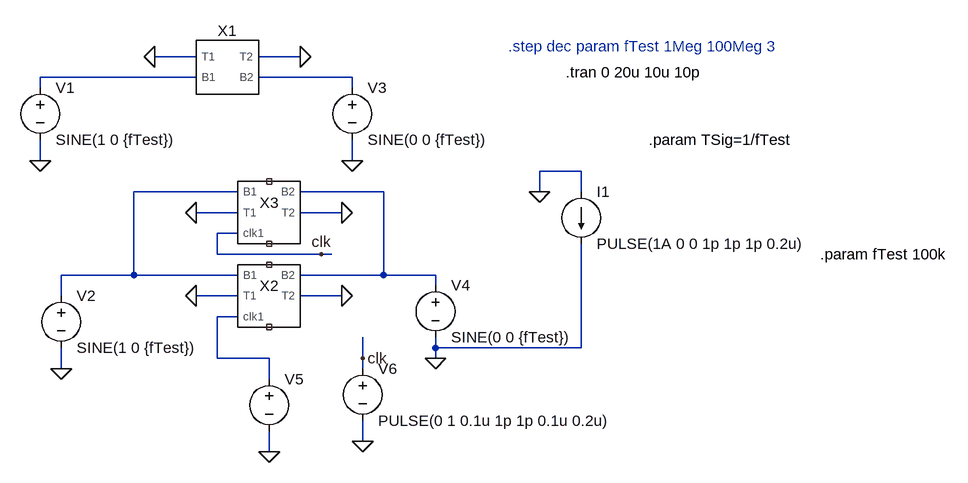
[diagram p0: schematic 4Term_TB.asc]
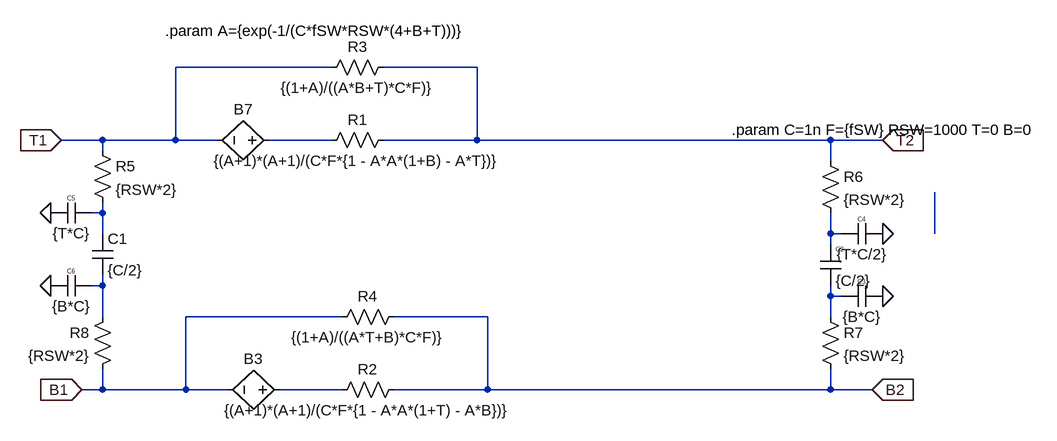
[diagram p1: sub-circuit 4term_model_eq.asc]
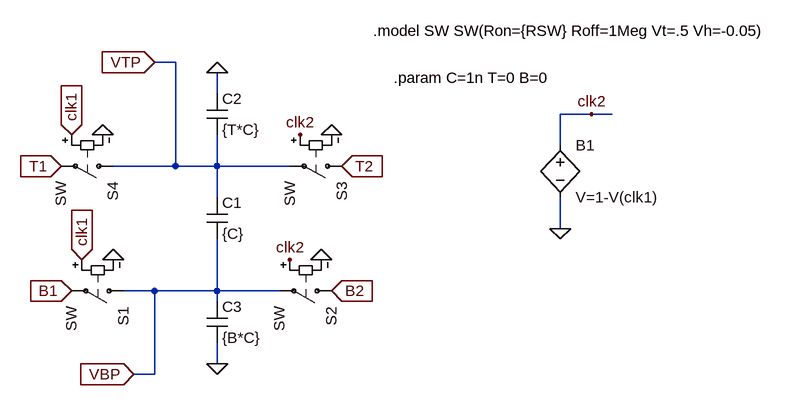
[diagram p2: sub-circuit sccore.asc]
4Term_TB.asc, the LTspice schematic file:
Version 4
SHEET 1 1288 788
WIRE 112 160 48 160
WIRE 272 160 208 160
WIRE 112 192 -128 192
WIRE 352 192 208 192
WIRE -128 208 -128 192
WIRE 352 208 352 192
WIRE -128 320 -128 288
WIRE 352 320 352 288
WIRE 704 336 640 336
WIRE 176 368 16 368
WIRE 400 368 272 368
WIRE 640 368 640 336
WIRE 704 368 704 336
WIRE 176 400 112 400
WIRE 336 400 272 400
WIRE 176 432 144 432
WIRE 144 464 144 432
WIRE 304 464 144 464
WIRE 320 464 304 464
WIRE 16 496 16 368
WIRE 16 496 -96 496
WIRE 176 496 16 496
WIRE 400 496 400 368
WIRE 400 496 272 496
WIRE 480 496 400 496
WIRE 480 512 480 496
WIRE -96 528 -96 496
WIRE 176 528 112 528
WIRE 336 528 272 528
WIRE 176 560 144 560
WIRE 480 608 480 592
WIRE 704 608 704 448
WIRE 704 608 480 608
WIRE 144 624 144 560
WIRE 224 624 144 624
WIRE 368 624 368 592
WIRE 480 624 480 608
WIRE -96 640 -96 608
WIRE 368 640 368 624
WIRE 224 656 224 624
WIRE 368 752 368 720
WIRE 224 768 224 736
FLAG -128 320 0
FLAG 352 320 0
FLAG 480 624 0
FLAG 272 160 0
FLAG 48 160 0
FLAG -96 640 0
FLAG 336 528 0
FLAG 112 528 0
FLAG 224 768 0
FLAG 336 400 0
FLAG 112 400 0
FLAG 368 752 0
FLAG 368 624 clk
FLAG 304 464 clk
FLAG 640 368 0
SYMBOL 4term_model_EQ 144 208 R0
SYMATTR InstName X1
SYMATTR SpiceLine C = 2n, RSW=1, B = 0.02, T = 0.02, fSW=5Meg
SYMBOL SCcore 224 528 R0
SYMATTR InstName X2
SYMATTR SpiceLine C = 1n, RSW=0.5, B = 0.02, T = 0.02
SYMBOL voltage -128 192 R0
WINDOW 123 0 0 Left 0
WINDOW 39 0 0 Left 0
SYMATTR InstName V1
SYMATTR Value SINE(1 0 {fTest})
SYMBOL voltage 352 192 R0
WINDOW 123 0 0 Left 0
WINDOW 39 0 0 Left 0
SYMATTR InstName V3
SYMATTR Value SINE(0 0 {fTest})
SYMBOL voltage 480 496 R0
WINDOW 123 0 0 Left 0
WINDOW 39 0 0 Left 0
SYMATTR InstName V4
SYMATTR Value SINE(0 0 {fTest})
SYMBOL voltage -96 512 R0
WINDOW 123 0 0 Left 0
WINDOW 39 0 0 Left 0
SYMATTR InstName V2
SYMATTR Value SINE(1 0 {fTest})
SYMBOL voltage 224 640 R0
WINDOW 3 24 96 Invisible 2
WINDOW 123 0 0 Left 0
WINDOW 39 0 0 Left 0
SYMATTR Value PULSE(0 1 0 1p 1p 0.1u 0.2u)
SYMATTR InstName V5
SYMBOL SCcore 224 400 R0
SYMATTR InstName X3
SYMATTR SpiceLine C = 1n, RSW=0.5, B = 0.02, T = 0.02
SYMBOL voltage 368 624 R0
WINDOW 123 0 0 Left 0
WINDOW 39 0 0 Left 0
SYMATTR InstName V6
SYMATTR Value PULSE(0 1 0.1u 1p 1p 0.1u 0.2u)
SYMBOL current 704 368 R0
WINDOW 123 0 0 Left 0
WINDOW 39 0 0 Left 0
SYMATTR InstName I1
SYMATTR Value PULSE(1A 0 0 1p 1p 1p 0.2u)
TEXT 592 144 Left 2 ;.step dec param fTest 1Meg 100Meg 3
TEXT 680 184 Left 2 !.tran 0 20u 10u 10p
TEXT 808 288 Left 2 !.param TSig=1/fTest
TEXT 1072 464 Left 2 !.param fTest 100k

4term_model_eq.asc, the sub-circuit schematic file:
Version 4
SHEET 1 2172 680
WIRE 912 -416 672 -416
WIRE 1136 -416 992 -416
WIRE 560 -304 496 -304
WIRE 672 -304 672 -416
WIRE 672 -304 560 -304
WIRE 736 -304 672 -304
WIRE 912 -304 816 -304
WIRE 1136 -304 1136 -416
WIRE 1136 -304 992 -304
WIRE 1680 -304 1136 -304
WIRE 1760 -304 1680 -304
WIRE 560 -288 560 -304
WIRE 1680 -272 1680 -304
WIRE 560 -192 560 -208
WIRE 560 -192 544 -192
WIRE 560 -160 560 -192
WIRE 1680 -160 1680 -192
WIRE 1696 -160 1680 -160
WIRE 1840 -160 1840 -224
WIRE 1680 -144 1680 -160
WIRE 560 -80 560 -96
WIRE 560 -80 544 -80
WIRE 1680 -64 1680 -80
WIRE 1696 -64 1680 -64
WIRE 560 -32 560 -80
WIRE 928 -32 688 -32
WIRE 1152 -32 1008 -32
WIRE 1680 -32 1680 -64
WIRE 560 80 560 48
WIRE 560 80 528 80
WIRE 688 80 688 -32
WIRE 688 80 560 80
WIRE 752 80 688 80
WIRE 928 80 832 80
WIRE 1152 80 1152 -32
WIRE 1152 80 1008 80
WIRE 1680 80 1680 48
WIRE 1680 80 1152 80
WIRE 1744 80 1680 80
FLAG 528 80 B1
IOPIN 528 80 In
FLAG 1744 80 B2
IOPIN 1744 80 In
FLAG 496 -304 T1
IOPIN 496 -304 In
FLAG 1760 -304 T2
IOPIN 1760 -304 In
FLAG 1760 -160 0
FLAG 1760 -64 0
FLAG 480 -192 0
FLAG 480 -80 0
SYMBOL bv 848 80 R90
WINDOW 0 -32 56 VBottom 2
WINDOW 3 32 56 Invisible 2
SYMATTR InstName B3
SYMATTR Value V=(V(T2) - V(T1))
SYMBOL res 1008 -320 R90
WINDOW 0 0 56 VBottom 2
WINDOW 3 32 56 VTop 2
SYMATTR InstName R1
SYMATTR Value {(A+1)*(A+1)/(C*F*{1 - A*A*(1+B) - A*T})}
SYMBOL bv 832 -304 R90
WINDOW 0 -32 56 VBottom 2
WINDOW 3 32 56 Invisible 2
SYMATTR InstName B7
SYMATTR Value V=(V(B2) - V(B1))
SYMBOL res 1008 -432 R90
WINDOW 0 0 56 VBottom 2
WINDOW 3 32 56 VTop 2
SYMATTR InstName R3
SYMATTR Value {(1+A)/((A*B+T)*C*F)}
SYMBOL res 1024 -48 R90
WINDOW 0 0 56 VBottom 2
WINDOW 3 32 56 VTop 2
SYMATTR InstName R4
SYMATTR Value {(1+A)/((A*T+B)*C*F)}
SYMBOL res 1024 64 R90
WINDOW 0 0 56 VBottom 2
WINDOW 3 32 56 VTop 2
SYMATTR InstName R2
SYMATTR Value {(A+1)*(A+1)/(C*F*{1 - A*A*(1+T) - A*B})}
SYMBOL res 1664 -288 R0
SYMATTR InstName R6
SYMATTR Value {RSW*2}
SYMBOL cap 544 -160 R0
SYMATTR InstName C1
SYMATTR Value {C/2}
SYMBOL cap 1664 -144 R0
WINDOW 0 24 8 Left 0
SYMATTR InstName C2
SYMATTR Value {C/2}
SYMBOL cap 1760 -80 R90
WINDOW 0 0 32 VBottom 0
WINDOW 3 32 32 VTop 2
SYMATTR InstName C3
SYMATTR Value {B*C}
SYMBOL cap 1760 -176 R90
WINDOW 0 0 32 VBottom 0
WINDOW 3 32 32 VTop 2
SYMATTR InstName C4
SYMATTR Value {T*C/2}
SYMBOL res 1664 -48 R0
SYMATTR InstName R7
SYMATTR Value {RSW*2}
SYMBOL res 544 -304 R0
SYMATTR InstName R5
SYMATTR Value {RSW*2}
SYMBOL res 576 -48 M0
SYMATTR InstName R8
SYMATTR Value {RSW*2}
SYMBOL cap 480 -208 M90
WINDOW 0 0 32 VBottom 0
WINDOW 3 32 32 VTop 2
SYMATTR InstName C5
SYMATTR Value {T*C}
SYMBOL cap 480 -96 M90
WINDOW 0 0 32 VBottom 0
WINDOW 3 32 32 VTop 2
SYMATTR InstName C6
SYMATTR Value {B*C}
TEXT 656 -472 Left 2 !.param A={exp(-1/(C*fSW*RSW*(4+B+T)))}
TEXT 1528 -320 Left 2 !.param C=1n F={fSW} RSW=1000 T=0 B=0

sccore.asc, the sub-circuit schematic file:
Version 4
SHEET 1 1152 680
WIRE 160 -128 128 -128
WIRE 224 -80 224 -112
WIRE 800 -48 752 -48
WIRE 832 -48 800 -48
WIRE 752 0 752 -48
WIRE 160 32 160 -128
WIRE 160 32 64 32
WIRE 224 32 224 -16
WIRE 224 32 160 32
WIRE 336 32 224 32
WIRE 224 80 224 32
WIRE 752 128 752 80
WIRE 128 224 80 224
WIRE 224 224 224 144
WIRE 224 224 128 224
WIRE 320 224 224 224
WIRE 224 240 224 224
WIRE 224 336 224 304
WIRE 128 352 128 224
WIRE 128 352 96 352
FLAG 224 336 0
FLAG 224 -112 0
FLAG 416 32 T2
IOPIN 416 32 In
FLAG -16 32 T1
IOPIN -16 32 In
FLAG 400 224 B2
IOPIN 400 224 In
FLAG 0 224 B1
IOPIN 0 224 In
FLAG 0 -16 clk1
IOPIN 0 -16 In
FLAG 16 176 clk1
IOPIN 16 176 In
FLAG 352 -16 clk2
FLAG 48 -16 0
FLAG 400 -16 0
FLAG 384 176 0
FLAG 64 176 0
FLAG 752 128 0
FLAG 800 -48 clk2
FLAG 336 176 clk2
FLAG 128 -128 VTP
IOPIN 128 -128 In
FLAG 96 352 VBP
IOPIN 96 352 In
SYMBOL cap 208 80 R0
SYMATTR InstName C1
SYMATTR Value {C}
SYMBOL cap 208 -80 R0
SYMATTR InstName C2
SYMATTR Value {T*C}
SYMBOL cap 208 240 R0
SYMATTR InstName C3
SYMATTR Value {B*C}
SYMBOL sw 96 224 R90
SYMATTR InstName S1
SYMBOL sw 416 224 R90
SYMATTR InstName S2
SYMBOL sw 432 32 R90
SYMATTR InstName S3
SYMBOL sw 80 32 R90
SYMATTR InstName S4
SYMBOL bv 752 -16 R0
SYMATTR InstName B1
SYMATTR Value V=1-V(clk1)
TEXT 464 -176 Left 2 !.model SW SW(Ron={RSW} Roff=1Meg Vt=.5 Vh=-0.05)
TEXT 496 -104 Left 2 !.param C=1n T=0 B=0

The netlist it stands for:
* 4Term_TB.asc
XX1 N001 N002 0 0 4term_model_eq params: C = 2n, RSW=1, B = 0.02, T = 0.02, fSW=5Meg
XX2 N003 N004 N005 0 0 NC_01 NC_02 sccore params: C = 1n, RSW=0.5, B = 0.02, T = 0.02
V1 N001 0 SINE(1 0 {fTest})
V3 N002 0 SINE(0 0 {fTest})
V4 N004 0 SINE(0 0 {fTest})
V2 N003 0 SINE(1 0 {fTest})
V5 N005 0 PULSE(0 1 0 1p 1p 0.1u 0.2u)
XX3 N003 N004 clk 0 0 NC_03 NC_04 sccore params: C = 1n, RSW=0.5, B = 0.02, T = 0.02
V6 clk 0 PULSE(0 1 0.1u 1p 1p 0.1u 0.2u)
I1 0 0 PULSE(1A 0 0 1p 1p 1p 0.2u)

* block symbol definitions
.subckt 4term_model_eq B1 B2 T1 T2
B3 N007 B1 V=(V(T2) - V(T1))
R1 T2 N001 {(A+1)*(A+1)/(C*F*{1 - A*A*(1+B) - A*T})}
B7 N001 T1 V=(V(B2) - V(B1))
R3 T2 T1 {(1+A)/((A*B+T)*C*F)}
R4 B2 B1 {(1+A)/((A*T+B)*C*F)}
R2 B2 N007 {(A+1)*(A+1)/(C*F*{1 - A*A*(1+T) - A*B})}
R6 T2 N003 {RSW*2}
C1 N002 N005 {C/2}
C2 N003 N006 {C/2}
C3 0 N006 {B*C}
C4 0 N003 {T*C/2}
R7 N006 B2 {RSW*2}
R5 T1 N002 {RSW*2}
R8 N005 B1 {RSW*2}
C5 0 N002 {T*C}
C6 0 N005 {B*C}
.param A={exp(-1/(C*fSW*RSW*(4+B+T)))}
.param C=1n F={fSW} RSW=1000 T=0 B=0
.ends 4term_model_eq

.subckt sccore B1 B2 clk1 T1 T2 VTP VBP
C1 VTP VBP {C}
C2 0 VTP {T*C}
C3 VBP 0 {B*C}
S1 VBP B1 clk1 0 SW
S2 B2 VBP clk2 0 SW
S3 T2 VTP clk2 0 SW
S4 VTP T1 clk1 0 SW
B1 clk2 0 V=1-V(clk1)
.model SW SW(Ron={RSW} Roff=1Meg Vt=.5 Vh=-0.05)
.param C=1n T=0 B=0
.ends sccore

* .step dec param fTest 1Meg 100Meg 3
.tran 0 20u 10u 10p
.param TSig=1/fTest
.param fTest 100k
.backanno
.end